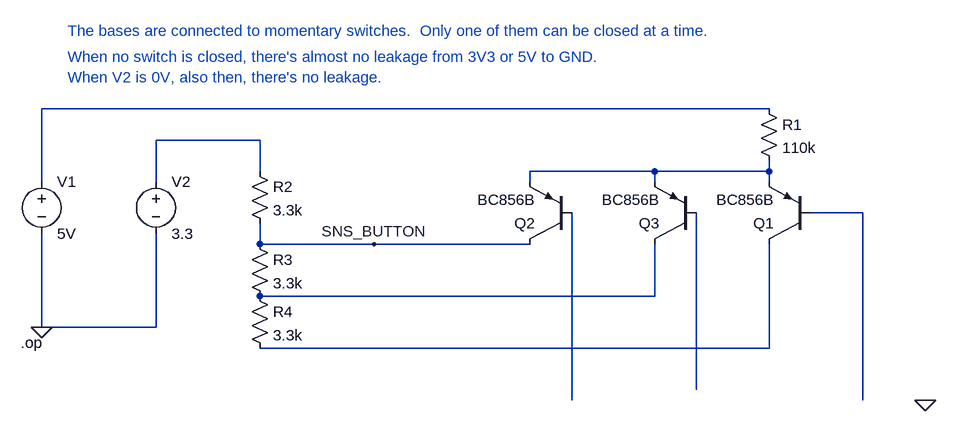
[diagram p0: schematic PNP-switching _element.asc]
PNP-switching _element.asc, the LTspice schematic file:
Version 4
SHEET 1 996 680
WIRE 736 16 -384 16
WIRE -48 64 -208 64
WIRE -48 112 -48 64
WIRE 560 112 368 112
WIRE 736 112 736 96
WIRE 736 112 560 112
WIRE -384 128 -384 16
WIRE -208 128 -208 64
WIRE 368 128 368 112
WIRE 560 128 560 112
WIRE 736 128 736 112
WIRE 880 176 800 176
WIRE -48 224 -48 192
WIRE 128 224 -48 224
WIRE 368 224 128 224
WIRE 560 304 560 224
WIRE 560 304 -48 304
WIRE -384 352 -384 208
WIRE -208 352 -208 208
WIRE -208 352 -384 352
WIRE 736 384 736 224
WIRE 736 384 -48 384
WIRE 624 448 624 176
WIRE 432 464 432 176
WIRE 880 464 880 176
FLAG -384 352 0
FLAG 128 224 SNS_BUTTON
FLAG 976 464 0
SYMBOL voltage -384 112 R0
WINDOW 123 0 0 Left 0
WINDOW 39 0 0 Left 0
SYMATTR InstName V1
SYMATTR Value 5V
SYMBOL res 720 0 R0
SYMATTR InstName R1
SYMATTR Value 110k
SYMBOL pnp 800 224 R180
SYMATTR InstName Q1
SYMATTR Value BC856B
SYMBOL res -64 96 R0
SYMATTR InstName R2
SYMATTR Value 3.3k
SYMBOL voltage -208 112 R0
WINDOW 123 0 0 Left 0
WINDOW 39 0 0 Left 0
SYMATTR InstName V2
SYMATTR Value 3.3
SYMBOL pnp 432 224 R180
SYMATTR InstName Q2
SYMATTR Value BC856B
SYMBOL pnp 624 224 R180
SYMATTR InstName Q3
SYMATTR Value BC856B
SYMBOL res -64 208 R0
SYMATTR InstName R3
SYMATTR Value 3.3k
SYMBOL res -64 288 R0
SYMATTR InstName R4
SYMATTR Value 3.3k
TEXT -416 376 Left 2 !.op
TEXT -344 -104 Left 2 ;The bases are connected to momentary switches.  Only one of them can be closed at a time.
TEXT -344 -64 Left 2 ;When no switch is closed, there's almost no leakage from 3V3 or 5V to GND.\nWhen V2 is 0V, also then, there's no leakage.

The netlist it stands for:
* PNP-switching _element.asc
V1 N001 0 5V
R1 N001 N003 110k
Q1 N006 N004 N003 0 BC856B
R2 N002 SNS_BUTTON 3.3k
V2 N002 0 3.3
Q2 SNS_BUTTON N008 N003 0 BC856B
Q3 N005 N007 N003 0 BC856B
R3 SNS_BUTTON N005 3.3k
R4 N005 N006 3.3k
.model NPN NPN
.model PNP PNP
.lib standard.bjt
.op
* The bases are connected to momentary switches.  Only one of them can be closed at a time.
* When no switch is closed, there's almost no leakage from 3V3 or 5V to GND.
* When V2 is 0V, also then, there's no leakage.
.backanno
.end